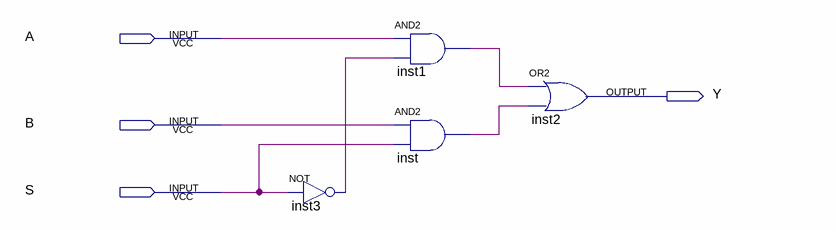
[diagram p0: schematic sheet]
// Quartus schematic mux2x1.bdf as structural Verilog: 4 symbols, 4 pins
module mux2x1 (
  input  A,
  input  B,
  input  S,
  output Y
);

  wire inst1_out, inst3_out, inst_out;

  not inst3 (inst3_out, S);
  and inst1 (inst1_out, A, inst3_out);
  and inst (inst_out, B, S);
  or inst2 (Y, inst1_out, inst_out);
endmodule
